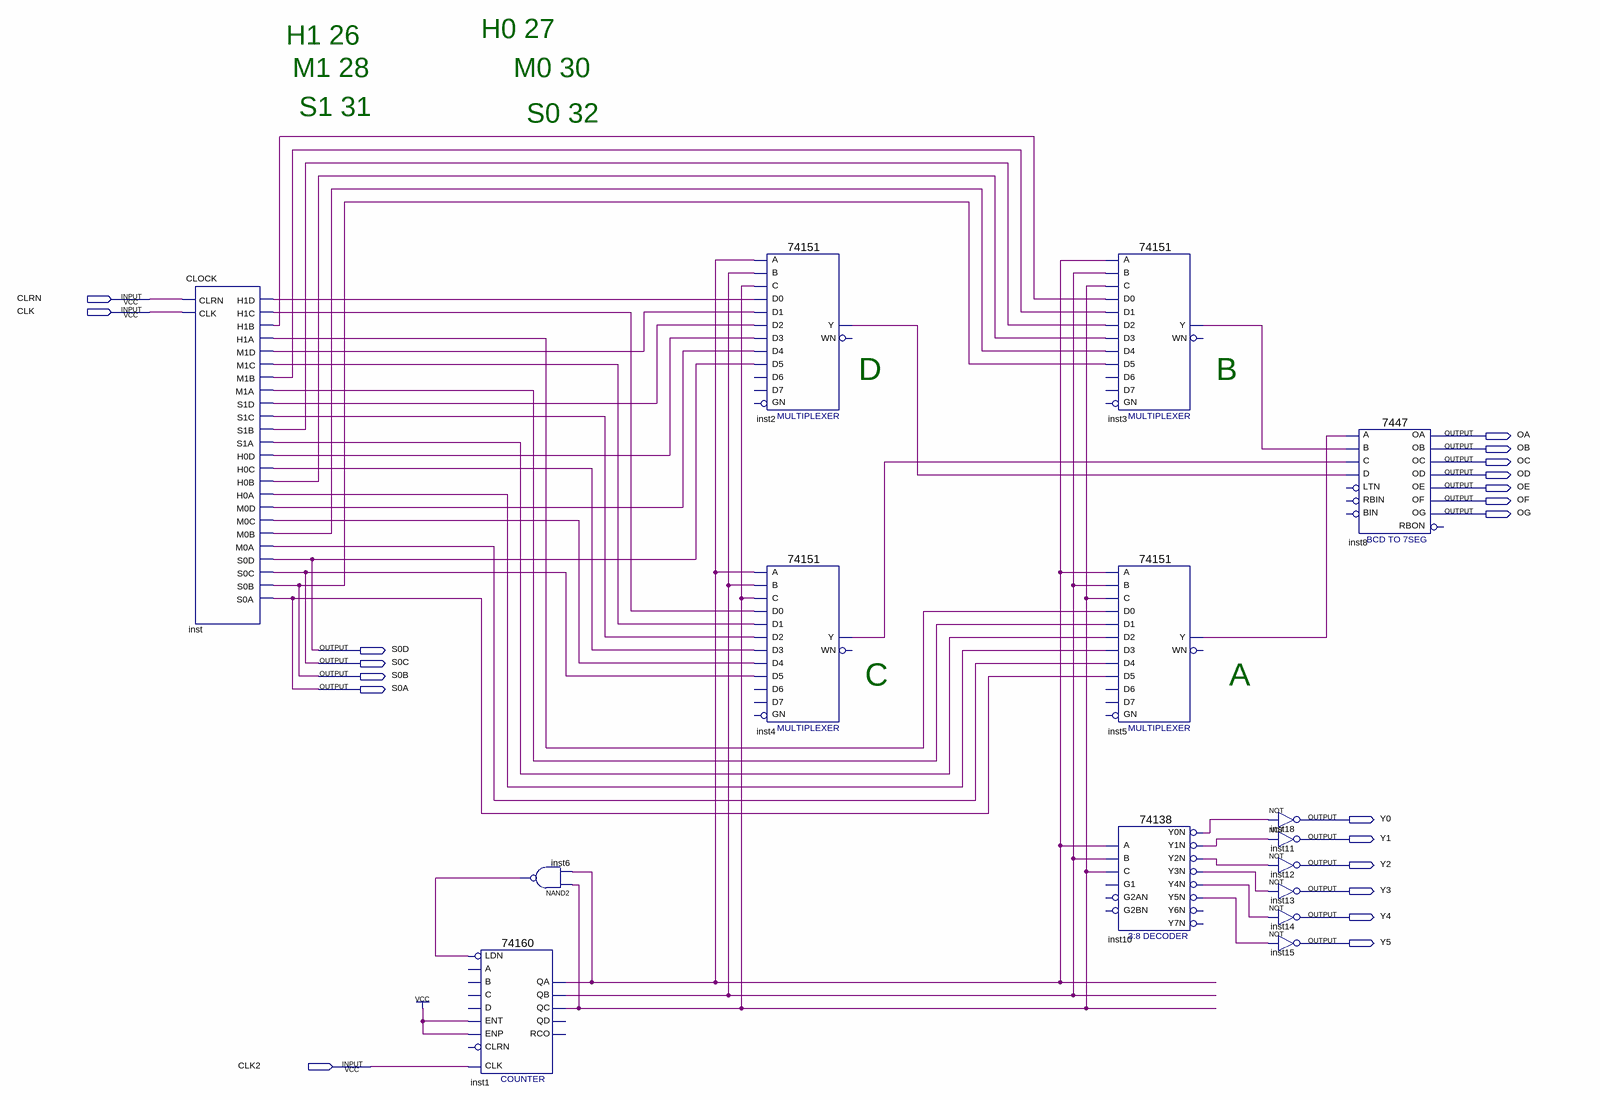
[diagram p0: schematic sheet]
// Quartus schematic shuzishizhong.bdf as structural Verilog: 15 symbols, 20 pins
module shuzishizhong (
  input  CLRN,
  input  CLK,
  input  CLK2,
  output OA,
  output OB,
  output OC,
  output OD,
  output OE,
  output OF,
  output OG,
  output S0D,
  output S0C,
  output S0B,
  output S0A,
  output Y0,
  output Y1,
  output Y2,
  output Y3,
  output Y4,
  output Y5
);

  wire inst1_qa, inst1_qb, inst1_qc, inst2_y, inst3_y, inst4_y, inst5_y, inst6_out, inst10_y0n, inst10_y1n,
       inst10_y2n, inst10_y3n, inst10_y4n, inst10_y5n, inst_h0a, inst_h0b, inst_h0c, inst_h0d, inst_h1a,
       inst_h1b, inst_h1c, inst_h1d, inst_m0a, inst_m0b, inst_m0c, inst_m0d, inst_m1a, inst_m1b, inst_m1c,
       inst_m1d, inst_s1a, inst_s1b, inst_s1c, inst_s1d;

  CLOCK inst (
    .CLRN(CLRN), .CLK(CLK), .H1D(inst_h1d), .H1C(inst_h1c), .H1B(inst_h1b), .H1A(inst_h1a), .M1D(inst_m1d),
    .M1C(inst_m1c), .M1B(inst_m1b), .M1A(inst_m1a), .S1D(inst_s1d), .S1C(inst_s1c), .S1B(inst_s1b),
    .S1A(inst_s1a), .H0D(inst_h0d), .H0C(inst_h0c), .H0B(inst_h0b), .H0A(inst_h0a), .M0D(inst_m0d),
    .M0C(inst_m0c), .M0B(inst_m0b), .M0A(inst_m0a), .S0D(S0D), .S0C(S0C), .S0B(S0B), .S0A(S0A));
  \74160  inst1 (
    .CLK(CLK2), .ENT(1'b1), .LDN(inst6_out), .ENP(1'b1), .QA(inst1_qa), .QB(inst1_qb), .QC(inst1_qc));  // open: A, B, C, D, CLRN, QD, RCO
  nand inst6 (inst6_out, inst1_qc, inst1_qa);
  \74151  inst2 (
    .C(inst1_qc), .B(inst1_qb), .A(inst1_qa), .D5(S0D), .D0(inst_h1d), .D1(inst_m1d), .D4(inst_m0d),
    .D3(inst_h0d), .D2(inst_s1d), .Y(inst2_y));  // open: GN, D6, D7, WN
  \74151  inst4 (
    .C(inst1_qc), .B(inst1_qb), .A(inst1_qa), .D5(S0C), .D0(inst_h1c), .D1(inst_m1c), .D4(inst_m0c),
    .D3(inst_h0c), .D2(inst_s1c), .Y(inst4_y));  // open: GN, D6, D7, WN
  \74151  inst3 (
    .C(inst1_qc), .B(inst1_qb), .A(inst1_qa), .D5(S0B), .D0(inst_h1b), .D1(inst_m1b), .D4(inst_m0b),
    .D3(inst_h0b), .D2(inst_s1b), .Y(inst3_y));  // open: GN, D6, D7, WN
  \74151  inst5 (
    .C(inst1_qc), .B(inst1_qb), .A(inst1_qa), .D5(S0A), .D0(inst_h1a), .D1(inst_m1a), .D4(inst_m0a),
    .D3(inst_h0a), .D2(inst_s1a), .Y(inst5_y));  // open: GN, D6, D7, WN
  \74138  inst10 (
    .A(inst1_qa), .B(inst1_qb), .C(inst1_qc), .Y0N(inst10_y0n), .Y1N(inst10_y1n), .Y2N(inst10_y2n),
    .Y3N(inst10_y3n), .Y4N(inst10_y4n), .Y5N(inst10_y5n));  // open: G1, G2AN, G2BN, Y6N, Y7N
  not inst18 (Y0, inst10_y0n);
  not inst11 (Y1, inst10_y1n);
  not inst12 (Y2, inst10_y2n);
  not inst13 (Y3, inst10_y3n);
  not inst14 (Y4, inst10_y4n);
  not inst15 (Y5, inst10_y5n);
  \7447  inst8 (
    .B(inst3_y), .C(inst4_y), .D(inst2_y), .A(inst5_y), .OB(OB), .OC(OC), .OE(OE), .OD(OD), .OF(OF), .OG(OG),
    .OA(OA));  // open: LTN, RBIN, BIN, RBON

  // Notes on the sheet:
  //   H0 27
  //   H1 26
  //   M1 28
  //   M0 30
  //   S1 31
  //   S0 32
  //   D
  //   B
  //   C
  //   A
endmodule
